# Altium schematic sheet config-bank4.SchDoc: Config FPGA - Bank 4
size Letter; CompanyName: Brinton Engineering, LLC; Address1: 3479 Edison Way; Address2: Menlo Park CA 94025; Address3: +1 (877) 778-8435; Address4: brintonengineering.com; Revision: 1; SheetNumber: 1; SheetTotal: 1
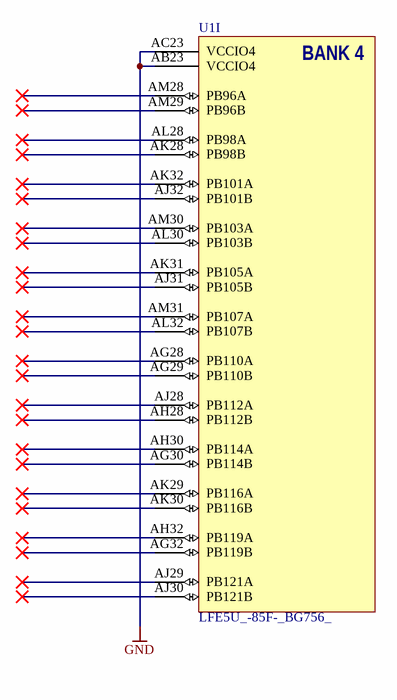
[diagram p0: config-bank4.SchDoc]

## Parts
U1  LFE5U_-85F-_BG756_  [caBGA756]  (part I of 19)

## Nets
GND: U1.AB23(VCCIO4) U1.AC23(VCCIO4)

Not connected (* = marked no-connect by the designer): U1 AG28(PB110A)* AG29(PB110B)* AG30(PB114B)* AG32(PB119B)* AH28(PB112B)* AH30(PB114A)* AH32(PB119A)* AJ28(PB112A)* AJ29(PB121A)* AJ30(PB121B)* AJ31(PB105B)* AJ32(PB101B)* AK28(PB98B)* AK29(PB116A)* AK30(PB116B)* AK31(PB105A)* AK32(PB101A)* AL28(PB98A)* AL30(PB103B)* AL32(PB107B)* AM28(PB96A)* AM29(PB96B)* AM30(PB103A)* AM31(PB107A)*

## Notes on the sheet
- Title
- Engineer
- Revision
- Drawn By
- Checked By
- Date
- Sheet
- of
- (in symbol LFE5U_-85F-_BG756_, part I) BANK 4

## Library data of the parts
U1 = LFE5U_-85F-_BG756_: ECP5 FPGA, 85k LUT, 756-caBGA; Manufacturer: Lattice Semiconductor; Manufacturer P/N: LFE5U_-85F-_BG756_